# Altium schematic sheet POWERSP_SCH.SchDoc
size 420 x 297 mm; SheetNumber: 3; SheetTotal: 5
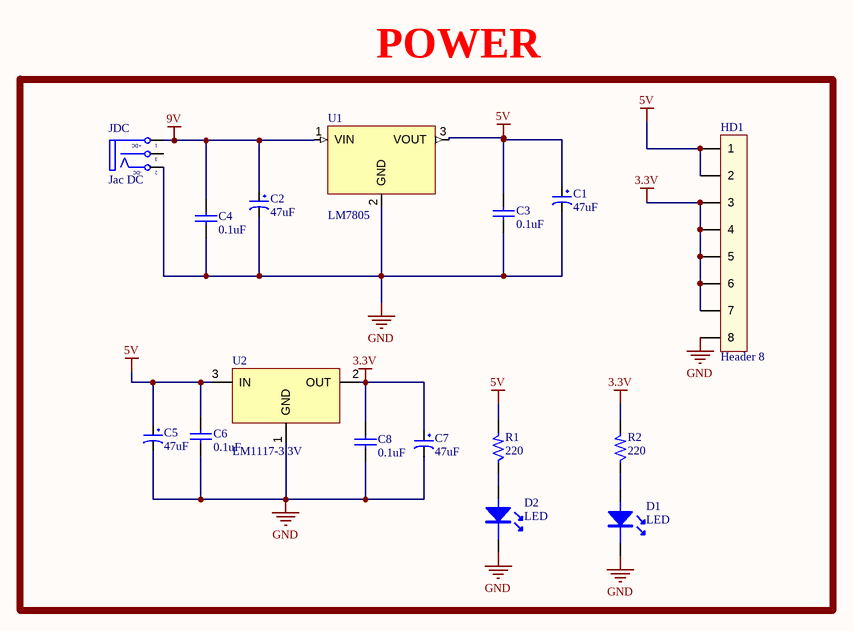
[diagram p0: POWERSP_SCH.SchDoc]

## Parts
C1  47uF  [CP1/2]
C2  47uF  [CP1/2]
C3  0.1uF  [CN3]
C4  0.1uF  [CN3]
C5  47uF  [CP1/2]
C6  0.1uF  [CN3]
C7  47uF  [CP1/2]
C8  0.1uF  [CN3]
D1  LED  [CAP10UF]
D2  LED  [CAP10UF]
HD1  Header 8  [HED8V]
JDC  Jac DC  [DC-IN]
R1  220  [R1/6W]
R2  220  [R1/6W]
U1  LM7805  [TO-220]
U2  LM1117-3.3V  [SOT223-4N]

## Sub-sheets
? = POWER: no entries

## Nets
3.3V: C7.1 C8.2 HD1.3 HD1.4 HD1.5 HD1.6 HD1.7 R2.2 U2.2(OUT)
5V: C1.1 C3.2 C5.1 C6.2 HD1.1 HD1.2 R1.2 U1.3(VOUT) U2.3(IN)
9V: C2.1 C4.2 JDC.1(T) U1.1(VIN)
GND: C1.2 C2.2 C3.1 C4.1 C5.2 C6.1 C7.2 C8.1 D1.2 D2.2 HD1.8 JDC.2(TN) U1.2(GND) U2.1(GND)
NetD1_1: D1.1 R2.1
NetD2_1: D2.1 R1.1

Not connected (* = marked no-connect by the designer): JDC 3(S)

## Notes on the sheet
- THIS DOCUMENT AND THE DATA DISCLOSED HEREIN OR
- HEREWITH IS THE PROPERTY OF ALTIUM LIMITED AND MAY
- DWG NO:
- REVISION
- REV:
- DESCRIPTION
- DATE
- APPROVED
- BE FREELY DISTRIBUTED IN WHOLE. NO RIGHTS ARE
- RESERVED OR EXPRESS OR IMPLIED WARANTEE GIVEN.
- ENG:
- APPROVALS
- PROJECT
- DSN:
- CHK:
- REFERENCE DOCUMENTS
- PROJECT REVISION:
- TITLE
- DOCUMENT REVISION:
- DESIGN ITEM:
- BOM:
- FAB DWG:
- PCB DWG:
- ASSY DWG:
- SCALE:
- A3
- SIZE
- CAGE CODE
- FILE NAME
- DWG NO.
- SHEET
- OF
- REV
- (in symbol DCIN) +DC; -DC

## Library data of the parts
C1 C2 C5 C7 = CP1: Cap P  0,1uF < 22uF , 16 - 50V; Value: 10uF/50V; Description 1: 10 => 220uF/6,3V/10V - 10uF => 100uF/16V; Description 2: 0,1uF => 33uF/50V - 10uF => 22uF/63V; Description 3: 0,47uF => 10uF/100V
C3 C4 C6 C8 = CAP 102 2KV: Capacitor (Semiconductor SIM Model); Published: 8-Jun-2000; LatestRevisionDate: 17-Jul-2002; LatestRevisionNote: Re-released for DXP Platform.; PackageReference: C1206; Publisher: Altium Limited; Value: 0.1uF
HD1 = Header 8: Header 8 Vit Broad
JDC = DCIN: Jac DC input; Value: Jac DC
R1 R2 = Res: Resistor 1/4W; Value: R1/4W - 1K
U1 = LM7805: TO-220; Text Field1: 70; Text Field2: 30
U2 = LM1117: 800mA Low-Dropout Linear Regulator; Creator: Nguyen Ba Bien; Website: http://group3i.net